# Altium project UiUxBoard6.PrjPcb
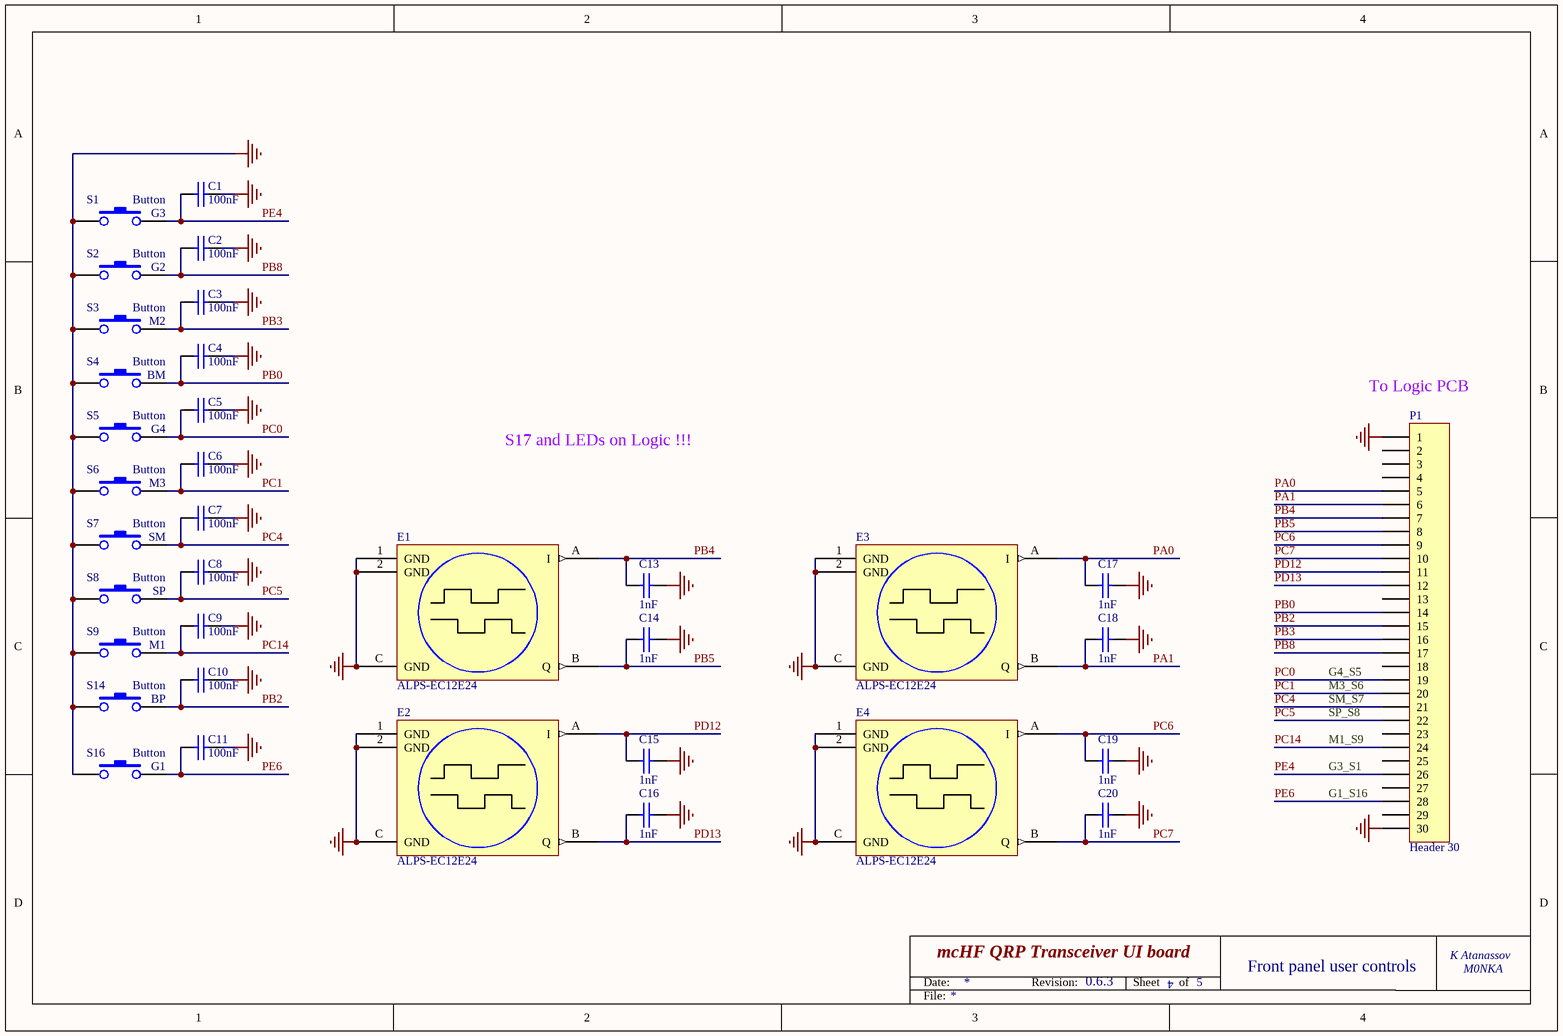
[diagram p0: ui_ux6.SchDoc]
1 sheet, 35 parts. Net scope: global (net labels, ports and power ports of the same name join across sheets).

## Sheet ui_ux6.SchDoc: mcHF QRP Transceiver UI board
size A4; Author: K Atanassov; CompanyName: M0NKA; Revision: 0.6.3; SheetTotal: 5

### Parts
C1  100nF  [0805-Pro]
C2  100nF  [0805-Pro]
C3  100nF  [0805-Pro]
C4  100nF  [0805-Pro]
C5  100nF  [0805-Pro]
C6  100nF  [0805-Pro]
C7  100nF  [0805-Pro]
C8  100nF  [0805-Pro]
C9  100nF  [0805-Pro]
C10  100nF  [0805-Pro]
C11  100nF  [0805-Pro]
C13  1nF  [0805-Pro]
C14  1nF  [0805-Pro]
C15  1nF  [0805-Pro]
C16  1nF  [0805-Pro]
C17  1nF  [0805-Pro]
C18  1nF  [0805-Pro]
C19  1nF  [0805-Pro]
C20  1nF  [0805-Pro]
E1  ALPS-EC12E24  [Encoder]
E2  ALPS-EC12E24  [Encoder]
E3  ALPS-EC12E24  [Encoder]
E4  ALPS-EC12E24  [Encoder]
P1  Header 30  [HDR1X30]
S1  Button  Software function: G3  [BUTTON_SMD2]
S2  Button  Software function: G2  [BUTTON_SMD2]
S3  Button  Software function: M2  [BUTTON_SMD2]
S4  Button  Software function: BM  [BUTTON_SMD2]
S5  Button  Software function: G4  [BUTTON_SMD2]
S6  Button  Software function: M3  [BUTTON_SMD2]
S7  Button  Software function: SM  [BUTTON_SMD2]
S8  Button  Software function: SP  [BUTTON_SMD2]
S9  Button  Software function: M1  [BUTTON_SMD2]
S14  Button  Software function: BP  [BUTTON_SMD2]
S16  Button  Software function: G1  [BUTTON_SMD2]

### Nets
GND: C1.1 C2.1 C3.1 C4.1 C5.1 C6.1 C7.1 C8.1 C9.1 C10.1 C11.1 C13.2 C14.2 C15.2 C16.2 C17.2 C18.2 C19.2 C20.2 E1.1(GND) E1.2(GND) E1.C(GND) E2.1(GND) E2.2(GND) E2.C(GND) E3.1(GND) E3.2(GND) E3.C(GND) E4.1(GND) E4.2(GND) E4.C(GND) P1.1 P1.30 S1.1 S2.1 S3.1 S4.1 S5.1 S6.1 S7.1 S8.1 S9.1 S14.1 S16.1
PA0: C17.1 E3.A(I) P1.5
PA1: C18.1 E3.B(Q) P1.6
PB0: C4.2 P1.14 S4.2
PB2: C10.2 P1.15 S14.2
PB3: C3.2 P1.16 S3.2
PB4: C13.1 E1.A(I) P1.7
PB5: C14.1 E1.B(Q) P1.8
PB8: C2.2 P1.17 S2.2
PC0: C5.2 P1.19 S5.2
PC1: C6.2 P1.20 S6.2
PC4: C7.2 P1.21 S7.2
PC5: C8.2 P1.22 S8.2
PC6: C19.1 E4.A(I) P1.9
PC7: C20.1 E4.B(Q) P1.10
PC14: C9.2 P1.24 S9.2
PD12: C15.1 E2.A(I) P1.11
PD13: C16.1 E2.B(Q) P1.12
PE4: C1.2 P1.26 S1.2
PE6: C11.2 P1.28 S16.2

Not connected (* = marked no-connect by the designer): P1 2 3 4 13 18 23 25 27 29

### Notes on the sheet
- S17 and LEDs on Logic !!!
- (near P1) To Logic PCB
- (near P1) SP_S8
- (near P1) SM_S7
- (near P1) M3_S6
- (near P1) G4_S5
- (near P1) G3_S1
- (near P1) M1_S9
- (near P1) G1_S16
- 4
- Front panel user controls
- Date:
- Revision:
- Sheet
- of
- File:

### Library data of the parts
C1-C11 = CAP: Capacitor; Order: FN 174-0673; QT Order: QCC-00154; Price: 0.068
C13-C20 = CAP: Capacitor; Order: FN 185-6408; QT Order: QCC-00259; Price: 0.01
E1-E4 = Encoder: ALPS Rotary Encoder; Order: FN 152-0812; Price: 1.00
P1 = Header 30: Header, 30-Pin; Order: NA; Price: 0.295
S1-S9 S14 S16 = SW-PB: Push Button; Order: EB 290913735944; Price: 0.14